# EAGLE design Grove - GPS (Air530)_v1.0_191111 (EAGLE 9.3.1)
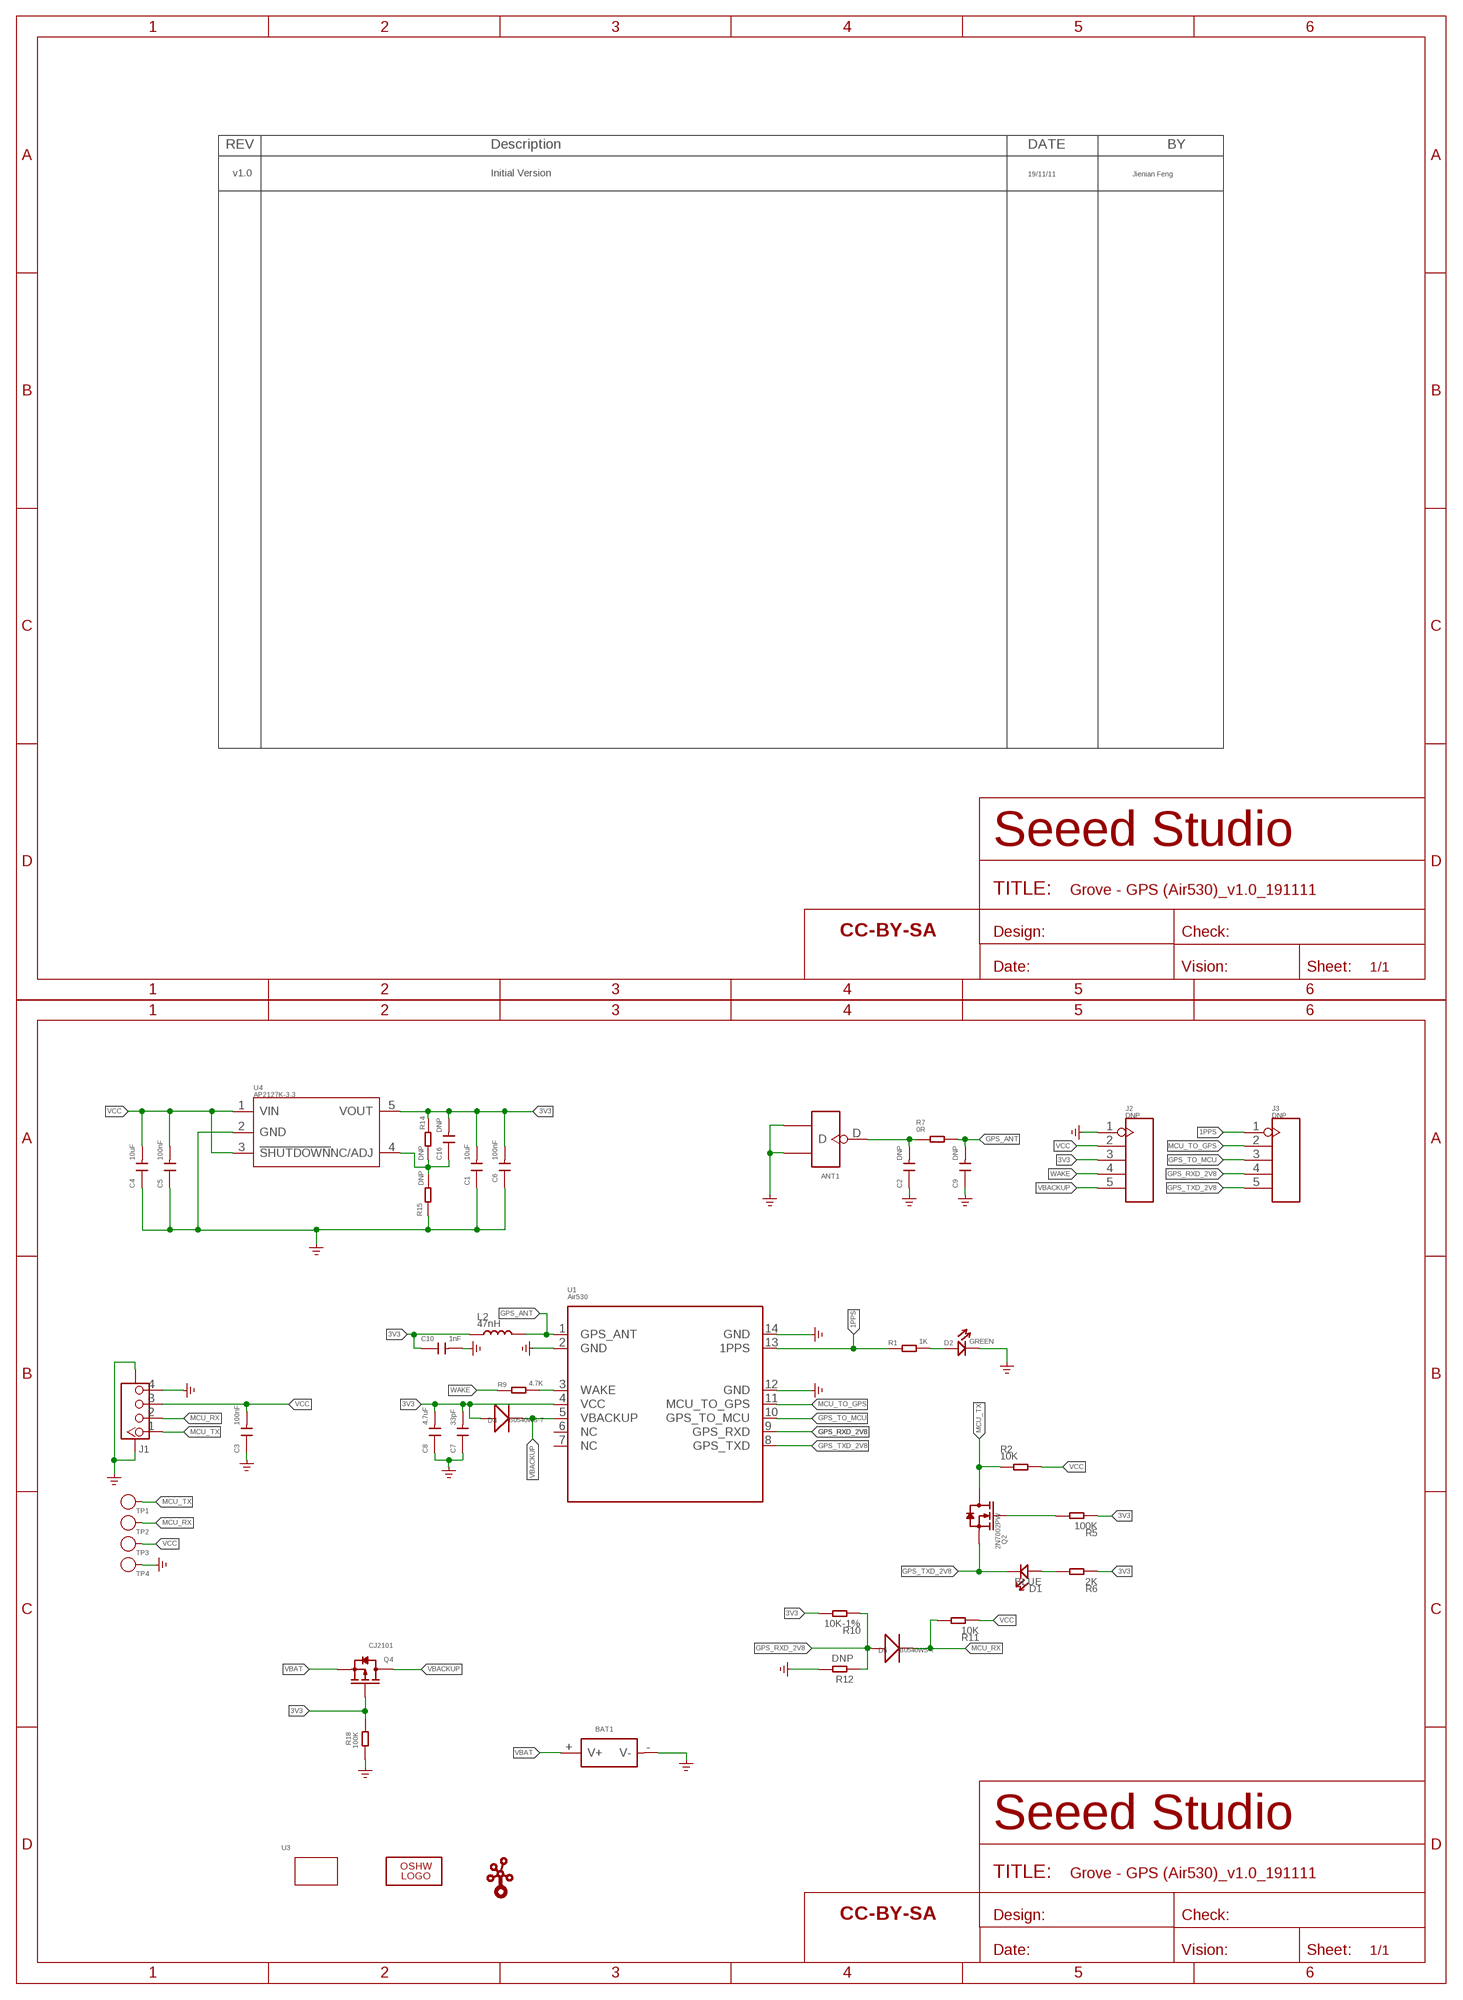
[diagram p0: schematic, sheet 1]

## Parts
ANT1  ANTENNA-U-FL-320110048  [U-FL3P-SMD-2.6X2.6X1.0MM]
BAT1  BAT-HOLDER'SMD-1220'  [BAT2P-SMD-16.4-CR1220]
C1  10uF  CAP-0603  [C0603]
C2  DNP  CAP-0402  [C0402]
C3  100nF  CAP-0402  [C0402]
C4  10uF  CAP-0603  [C0603]
C5  100nF  CAP-0402  [C0402]
C6  100nF  CAP-0402  [C0402]
C7  33pF  CAP-0402  [C0402]
C8  4.7uF  CAP-0402  [C0402]
C9  DNP  CAP-0402  [C0402]
C10  1nF  CAP-0402  [C0402]
C16  DNP  CAP-0402  [C0402]
D1  BLUE  LED-0402  [LED-0402]
D2  GREEN  LED-0402  [LED-0402]
D4  B0540WS-7  D'0805'  [SOD323]
D5  B0540WS-7  D'0805'  [SOD323]
FR1  SEEEDSTUDIO-OPEN-SCH-FRAME  [SEEEDSTUDIO-PCB-FRAME]
FR2  SEEEDSTUDIO-OPEN-SCH-FRAME  [SEEEDSTUDIO-PCB-FRAME]
J1  GROVE-CONNECTOR-SMD-320110030  [HW4-SMD-2.0]
J2  DNP  HEADER-5P-2.54  [H5-2.54]
J3  DNP  HEADER-5P-2.54  [H5-2.54]
L2  47nH  INDUCTOR'0402'  [L0402]
LOGO1  LOGO-OSHW-FILLX0200-NT  [OSHW_FILLX200_NOTEXT]
Q2  2N7002PW  MOSFET-N'SI1304BDL'  [SOT-323]
Q4  CJ2101  MOSFET-P-SOT323  [SOT-323]
R1  1K  RES-0402  [R0402]
R2  10K  RES-0402  [R0402]
R5  100K  RES-0402  [R0402]
R6  2K  RES-0402  [R0402]
R7  0R  RES-0402  [R0402]
R9  4.7K  RES-0402  [R0402]
R10  10K-1%  RES-0402  [R0402]
R11  10K  RES-0402  [R0402]
R12  DNP  RES-0402  [R0402]
R14  DNP  RES-0402  [R0402]
R15  DNP  RES-0402  [R0402]
R18  100K  RES-0402  [R0402]
TP1  TEST-POINT'4545'  [TP-D45MIL]
TP2  TEST-POINT'4545'  [TP-D45MIL]
TP3  TEST-POINT'4545'  [TP-D45MIL]
TP4  TEST-POINT'4545'  [TP-D45MIL]
U1  Air530  MODULE-GPS-AIR530-A10  [MOUDLE14-GPS-9.9X12.9MM]
U3  GROVE-1X2-TOP  [GROVE-1*2-TEST-PLATFORM-TOP]
U4  AP2127K-3.3  PMIC-AP2127  [SOT-23-5]
U$1  LOGO-GROVE  [GROVE-SILK-BIG]

## Nets
1PPS: J3.1 R1.1 U1.13(1PPS)
3V3: C1.2 C6.2 C7.2 C8.2 C10.1 C16.2 D4.+ J2.3 L2.1 Q4.1(G) R5.1 R6.1 R10.2 R14.2 R18.1 U1.4(VCC) U4.5(VOUT)
GND: ANT1.GND1 ANT1.GND2 BAT1.-(V-) C1.1 C2.1 C3.1 C4.1 C5.1 C6.1 C7.1 C8.1 C9.1 C10.2 D2.- J1.4 J1.SS1 J1.SS2 J2.1 R12.2 R15.1 R18.2 TP4.T U1.2(GND) U1.12(GND) U1.14(GND) U4.2(GND) ; supply symbol labelled GND_POWER
GPS_ANT: C9.2 L2.2 R7.2 U1.1(GPS_ANT)
GPS_RXD_2V8: D5.+ J3.4 R10.1 R12.1 U1.9(GPS_RXD)
GPS_TO_MCU: J3.3 U1.10(GPS_TO_MCU)
GPS_TXD_2V8: D1.- J3.5 Q2.2(S) U1.8(GPS_TXD)
MCU_RX: D5.- J1.2 R11.2 TP2.T
MCU_TO_GPS: J3.2 U1.11(MCU_TO_GPS)
MCU_TX: J1.1 Q2.3(D) R2.1 TP1.T
N$1: D2.+ R1.2
N$3: ANT1.D C2.2 R7.1
N$5: R9.2 U1.3(WAKE)
N$7: C16.1 R14.1 R15.2 U4.4(NC/ADJ)
N$8: D1.+ R6.2
N$11: Q2.1(G) R5.2
VBACKUP: D4.- J2.5 Q4.3(D) U1.5(VBACKUP)
VBAT: BAT1.+(V+) Q4.2(S)
VCC: C3.2 C4.2 C5.2 J1.3 J2.2 R2.2 R11.1 TP3.T U4.1(VIN) U4.3(!SHUTDOWN)
WAKE: J2.4 R9.1
Unconnected: U1.6(NC) U1.7(NC)

## Notes on the sheet
- v1.0 | Initial Version | 19/11/11 | Jienian Feng

## Library data of the parts
ANT1 = Connector-new:ANTENNA-U-FL
BAT1 = Connector-new:BAT-HOLDER: BAT2P-13.5-CR1220:320170002;BAT2P-SMD-20.5-CR1632:320170007;METAL-CR2032-D20.0*H6.3MM:320170003;METAL-CR2032-SMD:320170006;PLASTIC-CR1220-L15.06*W13.0*H4.1MM:320170000;PLASTIC-CR2032-L25.2*W15.6*H5.2MM:320170005;BAT2P-11.55-D12.55-CR1220:313010022
C1-C10 C16 = Discrete-new:CAP: Ceramic Capacitors
D1 D2 = Discrete-new:LED
D4 D5 = Discrete-smallsmall:D*
FR1 FR2 = moudle-new:SEEEDSTUDIO-OPEN-SCH-FRAME
J1 = Connector-new:GROVE-CONNECTOR-SMD
J2 J3 = Connector-new:HEADER-5P
L2 = Discrete-new:INDUCTOR
LOGO1 = logo:LOGO-OSHW-FILL; PARTNO: DNP
Q2 = Discrete-new:MOSFET-N: IRLL014: http://www.vishay.com/docs/91319/sihll014.pdf
Q4 = Discrete-new:MOSFET-P
R1 R2 R5-R7 R9-R12 R14 R15 R18 = Discrete-new:RES
TP1-TP4 = Discrete-new:TEST-POINT; PARTNO: DNP
U1 = moudle-new:MODULE-GPS-AIR530-A10
U3 = moudle-new:GROVE
U4 = IC-new:PMIC-AP2127
U$1 = logo:LOGO-GROVE; PARTNO: DNP

## Board
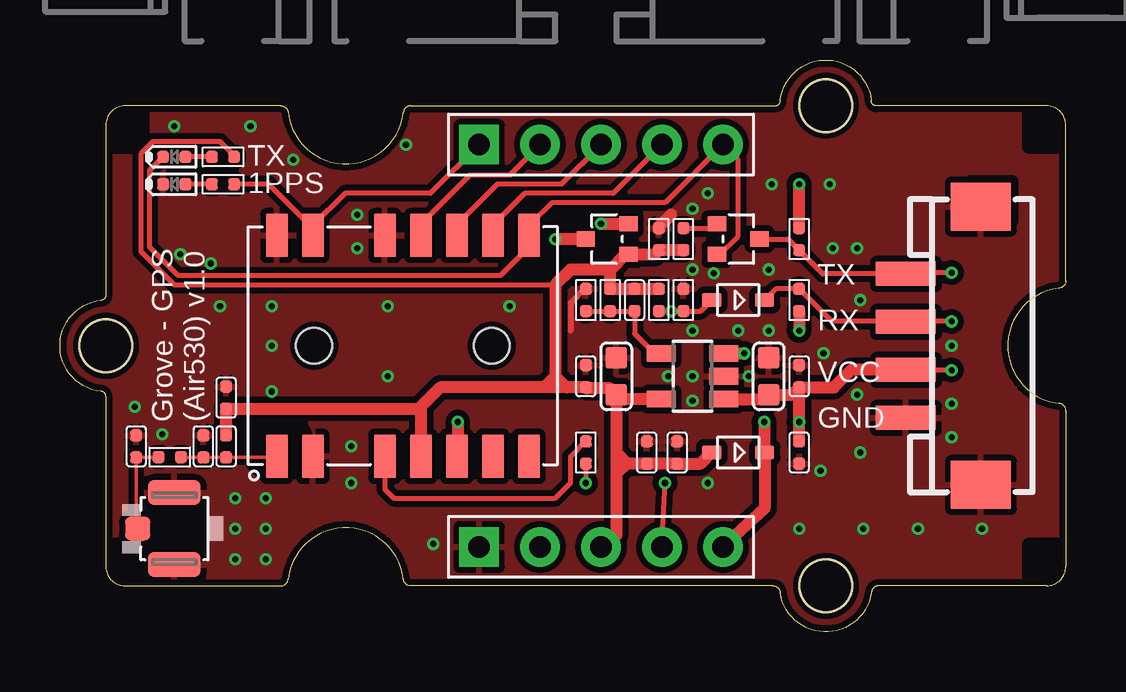
[diagram p1: board, top side]
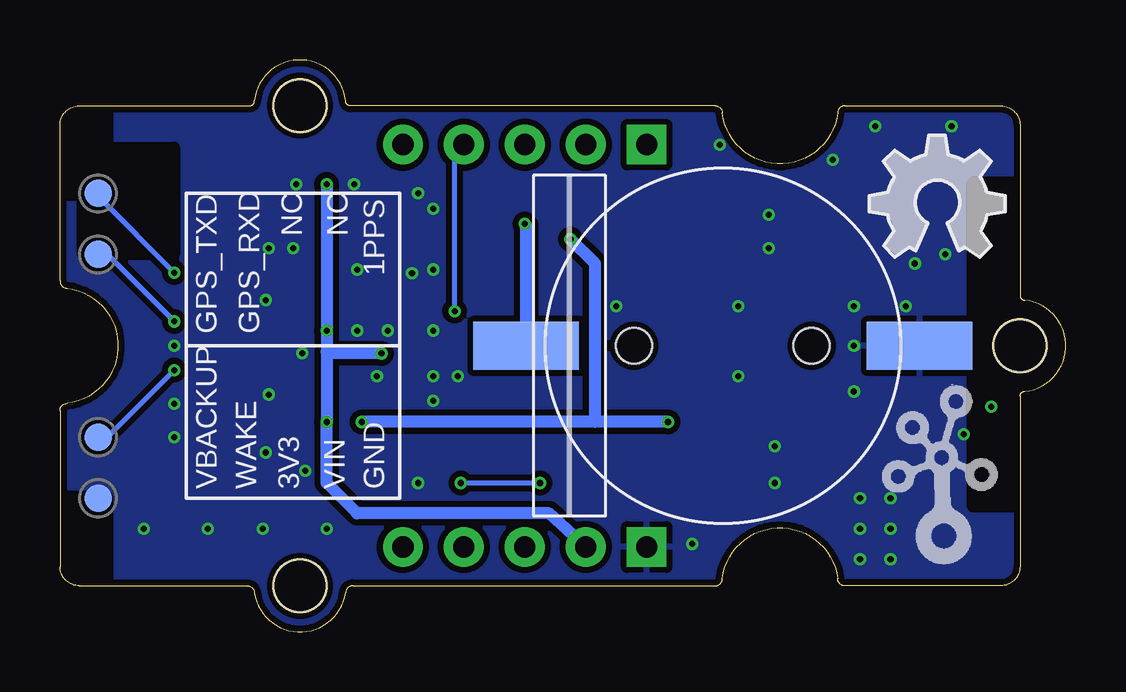
[diagram p2: board, bottom side, seen from below]

Size 41.91 x 23.83 mm. Coordinates in mm from the lower left corner, seen from the top.
Copper layers (1*16): Top 0.035mm / dielectric 1.5mm / Bottom 0.035mm
Design rules "SeeedStudio_2layer_DRU_no_angle_20140221": minimum track width 1mil, minimum drill 10mil, track to track 6mil, track to pad 6mil, pad to pad 6mil, via to via 6mil, smd to smd 0mil, copper to edge 10mil, drill to drill 10mil, minimum pad ring 4mil, minimum via ring 4mil, stop-mask expansion 2mil, vias tented up to drill 25mil, thermal gap 10mil
tRestrict: area 37.9,17.1 to 39.7,18.8; 13 lines
bRestrict: area 37.1,15.7 to 41,20.2

### Footprints (pad centres in the part's own frame; a part is rotated, then mirrored left to right if it is on the bottom)
U-FL3P-SMD-2.6X2.6X1.0MM = smd 1.05 x 1: D -1.524,0 | smd 2.2 x 1.05: GND1 0,1.5; GND2 0,-1.5
BAT2P-SMD-16.4-CR1220 = smd 2 x 4.4: + 0,-8.2; - 0,8.2 | hole 1.5: 0,3.7; 0,-3.7
C0603 = smd 0.889 x 0.889: 1 -0.762,0; 2 0.762,0
C0402 = smd 0.5 x 0.5: 1 -0.463,0; 2 0.463,0
LED-0402 = smd 0.5 x 0.5: + 0.463,0; - -0.463,0
SOD323 = smd 0.8 x 0.6: + -1.1,0; - 1.1,0
HW4-SMD-2.0 = smd 1 x 2.5: 1 -3,0; 2 -1,0; 3 1,0; 4 3,0 | smd 2 x 2.5: SS1 -5.8,3.123; SS2 5.8,3.123
H5-2.54 = drill 0.889 pad 1.651 square: 1 0,5.08 | drill 0.889 pad 1.651: 2 0,2.54; 3 0,0; 4 0,-2.54; 5 0,-5.08
L0402 = smd 0.5 x 0.5: 1 -0.463,0; 2 0.463,0
SOT-323 = smd 0.762 x 0.635: 1 0.889,-0.635; 2 0.889,0.635; 3 -0.889,0
R0402 = smd 0.5 x 0.5: 1 -0.463,0; 2 0.463,0
TP-D45MIL = smd 1.143 x 1.143: T 0,0
MOUDLE14-GPS-9.9X12.9MM = smd 1.8 x 0.9: 1 -4.6,5.25; 2 -4.6,3.75; 3 -4.6,0.75; 4 -4.6,-0.75; 5 -4.6,-2.25; 6 -4.6,-3.75; 7 -4.6,-5.25; 8 4.6,-5.25; 9 4.6,-3.75; 10 4.6,-2.25; 11 4.6,-0.75; 12 4.6,0.75; 13 4.6,3.75; 14 4.6,5.25
GROVE-1*2-TEST-PLATFORM-TOP = hole 2.2: 10.635,10; 10.635,-10; -19.365,0
SOT-23-5 = smd 0.69 x 1.2: 1 -0.95,-1.3; 2 0,-1.3; 3 0.95,-1.3; 4 0.95,1.3; 5 -0.95,1.3

### Placement (x,y rotation side)
ANT1  4.76,4.3 0 top
BAT1  14.29,11.92 270 bottom
C1  23.18,10.65 270 top
C2  3.18,7.73 270 top
C3  30.8,10.65 270 top
C4  29.53,10.65 270 top
C5  30.8,7.48 90 top
C6  21.91,10.65 270 top
C7  25.72,7.48 270 top
C8  24.45,7.48 270 top
C9  5.97,7.73 270 top
C10  6.92,9.76 90 top
C16  23.94,13.83 90 top
D1  4.76,19.8 0 top
D2  4.76,18.65 0 top
D4  28.26,7.48 0 top
D5  28.26,13.83 0 top
FR1  -16.95,-60.85 0 top  (outside the outline)
FR2  -17.97,-68.47 0 top  (outside the outline)
J1  35.24,11.92 270 top
J2  22.54,3.54 90 top
J3  22.54,20.3 90 top
L2  6.92,7.73 270 top
LOGO1  8.19,15.6 0 bottom
Q2  28.26,16.37 180 top
Q4  22.8,16.37 0 top
R1  6.8,18.65 180 top
R2  30.8,16.37 90 top
R5  25.97,16.37 90 top
R6  6.8,19.8 180 top
R7  4.57,7.29 0 top
R9  21.91,7.48 90 top
R10  24.96,13.83 90 top
R11  30.8,13.83 90 top
R12  25.97,13.83 90 top
R14  22.92,13.83 90 top
R15  21.91,13.83 270 top
R18  24.96,16.37 90 top
TP1  40.32,18.27 0 bottom
TP2  40.32,15.73 0 bottom
TP3  40.32,8.11 0 bottom
TP4  40.32,5.57 0 bottom
U1  14.29,11.92 90 top
U3  21.27,11.92 0 top
U4  26.35,10.65 90 top
U$1  5.14,3.79 0 bottom

### Tracks (layer width: path | path; a pad name or v marks a point on that pad's centre or on a via)
1PPS
  Top 0.203: J3.1 15.43,18.27 11.88,18.27 10.54,16.93 U1.13 10.54,16.81 8.7,18.65 R1.1
3V3
  Top 0.203: 15.05,7.33 U1.4 | R6.1 7.26,19.84 6.67,20.43 3.87,20.43 3.37,19.92 3.37,15.86 4.76,14.46 20.51,14.46 20.64,14.33
  Top 0.508: R5.1 R18.1 24.78,15.73 Q4.1 23.56,15.73 22.92,15.1 | R10.2 C16.2 R14.2 22.92,15.1 | U4.5 23.37,9.7 C1.2 | C1.2 22.92,10.14 21.95,10.14 C6.2 21.1,10.19 | L2.1 C10.1 14.96,9.3 | D4.+ 26.7,7.01 C7.2 C8.2 23.64,7.01 | C1.2 23.18,7.48 | 23.18,7.48 23.18,6.97 | 23.61,7.01 23.22,7.01 23.18,6.97 | 23.18,6.97 23.18,6.59 | 23.18,6.59 23.18,4.05 J2.3 | 21.1,10.19 20.64,10.19 | 20.64,10.19 15.85,10.19 14.96,9.3 | 15.05,7.33 15.05,9.21 14.96,9.3 | 22.92,15.1 21.27,15.1 20.64,14.46 20.64,14.33 20.64,10.65 | 20.64,10.65 20.64,10.19 | 23.64,7.01 23.18,7.48 | 23.64,7.01 23.61,7.01 | 23.61,7.01 23.18,6.59 | 21.1,10.19 20.64,10.65 | 20.64,10.65 20.26,10.27
GND  (via drill 0.25 pad 0.51)
  Top 0.254: R15.1 21.86,14.29 21.27,13.7 21.27,12.56
  Top 0.508: R18.2 24.96,16.87 25.46,17.38
  other vias: 5.02,15.73 9.72,19.67 13.65,13.57 7.94,21.07 13.65,10.65 14.42,20.3 29.66,18.65 7.3,5.57 8.57,5.57 15.56,3.67 12.13,6.21 7.3,3.03 7.3,4.3 8.57,4.3 4.26,8.24 8.83,11.92 12.13,7.73 8.57,3.03 33.21,9.89 31.81,11.62 33.34,13.83 33.21,15.99 31.69,6.71 33.34,7.48 33.47,4.3 35.75,4.3 37.15,8.11 37.15,9.51 37.15,11.92 38.42,4.3 8.83,10.02 29.53,12.56 26.35,17.64 32.07,18.65 30.8,4.3 3.11,9.38 27.24,14.94 26.99,18.27 29.53,15.1 26.35,15.1 28.26,12.56 26.35,12.56 26.35,10.65 26.99,6.21 26.35,9.64 25.34,10.65 28.7,10.65 32.2,15.99 6.67,13.57 8.83,13.57 18.73,13.57 12.38,17.38 12.38,15.99 6.29,15.35 4.76,21.07
  pour Bottom (isolate 0.254): -0.32,23.99 42.23,23.99 42.23,-0.14 -0.32,-0.14
  pour Top (isolate 0.254): -0.32,23.99 42.23,23.99 42.23,-0.14 -0.32,-0.14
GPS_ANT
  Top 0.145: 8.98,7.27 L2.2 C9.2 5.05,7.27
  Top 0.203: 5.05,7.27 R7.2 | 8.98,7.27 U1.1
GPS_RXD_2V8  (via drill 0.25 pad 0.51)
  Top 0.203: J3.4 23.05,18.27 19.37,18.27 18.35,17.26 18.35,16.84 U1.9 | R10.1 v25.46,13.36 R12.1 26.7,13.36 D5.+
  Bottom 0.203: v25.46,13.36 25.46,19.92 J3.4
GPS_TO_MCU
  Top 0.203: J3.3 20.89,18.65 18.23,18.65 16.83,17.26 16.83,16.81 U1.10
GPS_TXD_2V8
  Top 0.203: Q2.2 27.5,15.73 28.26,16.49 28.26,19.67 J3.5 25.21,17.89 20.51,17.89 19.62,17 19.62,16.61 U1.8 19.54,16.03 18.35,14.84 4.93,14.84 3.75,16.03 3.75,19.24 D1.-
MCU_RX  (via drill 0.25 pad 0.51)
  Top 0.203: v37.15,12.94 35.26,12.94 | 35.26,12.94 J1.2 | 35.26,12.94 32.15,12.94 R11.2 29.82,14.29 D5.-
  Bottom 0.203: TP2.T 39.94,15.73 v37.15,12.94
MCU_TO_GPS
  Top 0.203: J3.2 18.73,19.03 17.08,19.03 15.04,16.99 U1.11
MCU_TX  (via drill 0.25 pad 0.51)
  Top 0.203: v37.15,14.97 35.29,14.97 J1.1 31.78,14.92 R2.1 30.34,16.37 Q2.3
  Bottom 0.203: TP1.T 40.32,18.14 v37.15,14.97
N$1
  Top 0.203: R1.2 D2.+
N$3
  Top 0.145: R7.1 3.19,7.29 | C2.2 3.18,4.37
  Top 0.203: 3.19,7.29 C2.2 | 3.18,4.37 ANT1.D
N$5
  Top 0.203: U1.3 13.54,5.94 13.91,5.57 20.64,5.57 21.27,6.21 21.27,7.3 R9.2
N$7
  Top 0.203: R15.2 R14.1 C16.1 23.94,12.43 24.77,11.6 U4.4
N$8
  Top 0.203: R6.2 D1.+
N$11
  Top 0.203: R5.2 27.2,16.83 Q2.1
VBACKUP  (via drill 0.25 pad 0.51)
  Top 0.508: J2.5 29.36,5.15 D4.- 29.34,7.5 v29.34,8.75 | Q4.3 v20.64,16.37 | v16.57,8.75 16.57,7.36 U1.5
  Bottom 0.508: 19.62,8.75 19.62,15.35 v20.64,16.37 | v16.57,8.75 19.62,8.75 | 19.62,8.75 v29.34,8.75
VBAT  (via drill 0.25 pad 0.51)
  Top 0.508: v22.54,17 Q4.2
  Bottom 0.508: BAT1.+ 22.49,16.95 v22.54,17
VCC  (via drill 0.25 pad 0.51)
  Top 0.203: v37.15,10.91 35.26,10.91 J1.3
  Top 0.508: U4.1 29.34,9.7 C4.2 30.5,9.89 C3.2 | C3.2 v30.8,8.75 C5.2 | J1.3 32.97,10.92 32.24,10.19 C3.2 | R11.1 v30.8,12.56 | R2.2 v30.8,18.65 | U4.3 v28.51,11.6
  Bottom 0.203: TP3.T 39.94,8.11 v37.15,10.91
  Bottom 0.508: 30.8,11.67 v30.8,12.56 v30.8,18.65 | 30.8,11.67 v30.8,8.75 30.8,6.21 29.53,4.94 21.53,4.94 J2.2 | v28.51,11.6 30.73,11.6 30.8,11.67
WAKE  (via drill 0.25 pad 0.51)
  Top 0.203: J2.4 v25.21,6.21 | R9.1 v21.91,6.21
  Bottom 0.203: v25.21,6.21 v21.91,6.21

### Text on the board
tPlace: TX
tNames: 1PPS | TX | RX | VCC | Grove - GPS / (Air530) v1.0 | GND
bNames: NC | NC | 1PPS | GPS_RXD | GPS_TXD | GND | VIN | 3V3 | WAKE | VBACKUP